# Altium project Hardware Hyperspace Chattels- master.PrjPCB
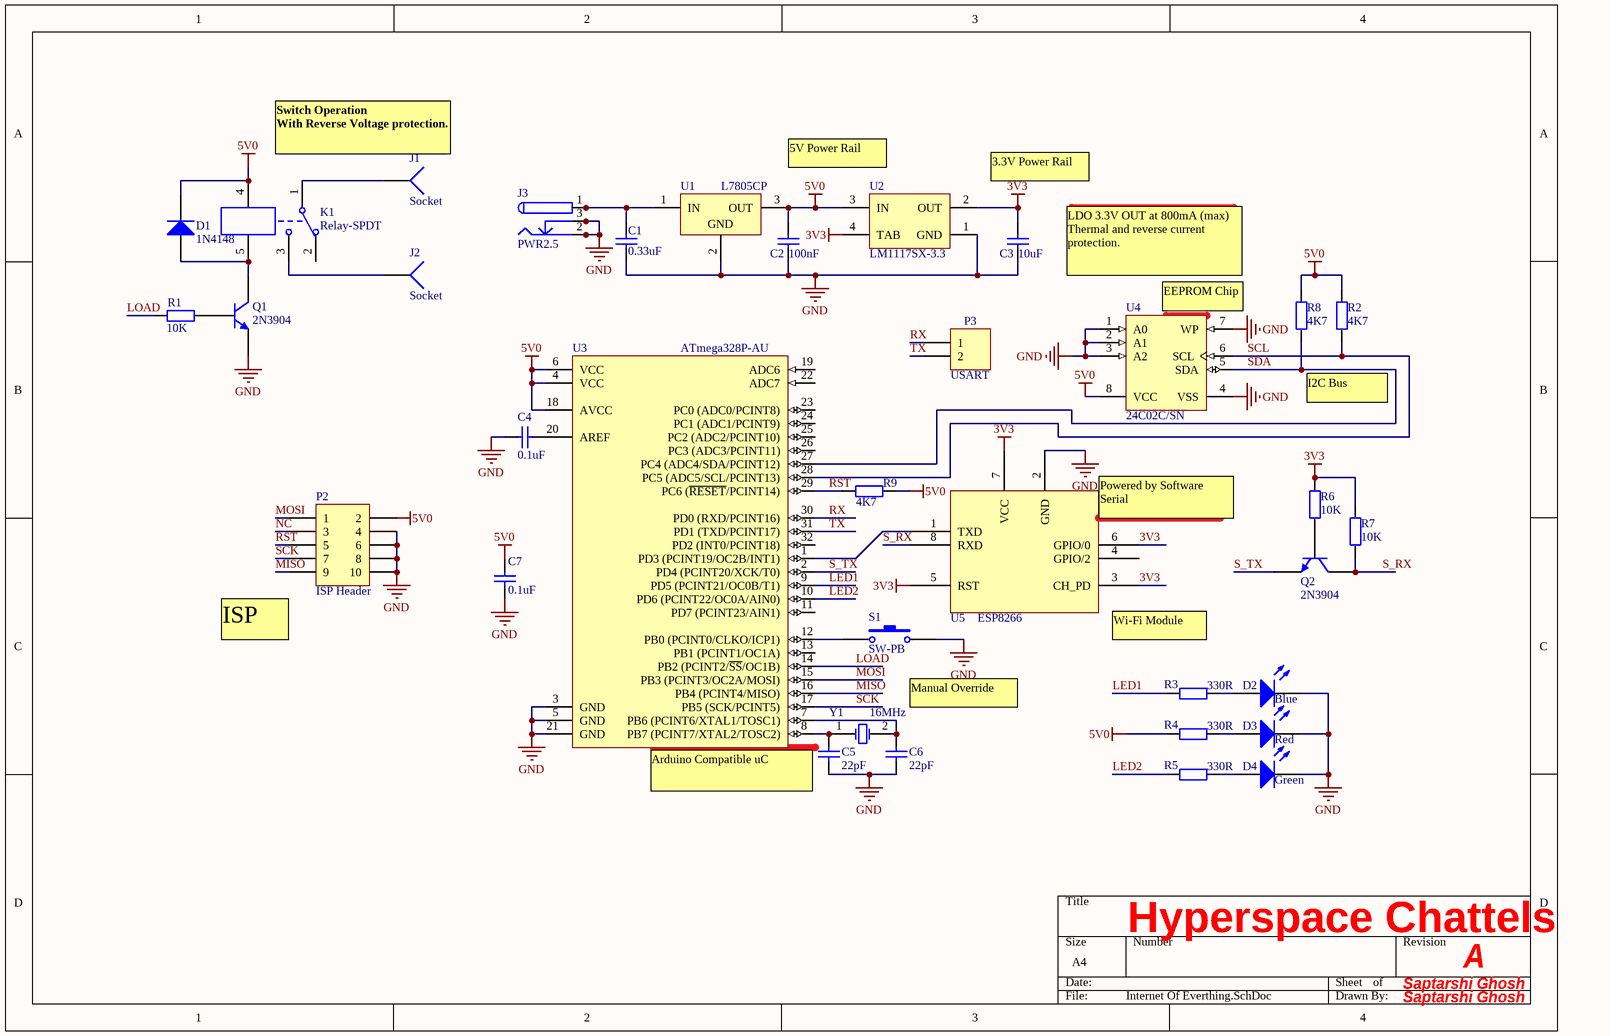
[diagram p0: Internet Of Everthing.SchDoc]
1 sheet, 35 parts. Net scope: global (net labels, ports and power ports of the same name join across sheets).
Board file: Internet Of Everthing.PcbDoc

## Sheet Internet Of Everthing.SchDoc
size A4

### Parts
C1  value 0.33uF  [6-0805_M]  (hidden comment: Cap)
C2  value 100nF  [6-0805_M]  (hidden comment: Cap)
C3  value 10uF  [6-0805_M]  (hidden comment: Cap)
C4  value 0.1uF  [6-0805_M]  (hidden comment: Cap)
C5  value 22pF  [6-0805_M]  (hidden comment: Cap)
C6  value 22pF  [6-0805_M]  (hidden comment: Cap)
C7  value 0.1uF  [6-0805_M]  (hidden comment: Cap)
D1  1N4148  [SOD-323]
D2  LED0  [6-0805_M]  (value not drawn)
D3  LED0  [6-0805_M]  (value not drawn)
D4  LED0  [6-0805_M]  (value not drawn)
J1  Socket  [PIN1]
J2  Socket  [PIN1]
J3  PWR2.5  [KLD-0202]
K1  Relay-SPDT  [G5LA-141]
P2  ISP Header  [HDR2X5]
P3  USART  [HDR1X2]
Q1  2N3904  [SOT-23_M]
Q2  2N3904  [SOT-23_M]
R1  value 10K  [6-0805_M]  (hidden comment: Res2)
R2  value 4K7  [6-0805_M]  (hidden comment: Res2)
R3  value 330R  [6-0805_M]  (hidden comment: Res2)
R4  value 330R  [6-0805_M]  (hidden comment: Res2)
R5  value 330R  [6-0805_M]  (hidden comment: Res2)
R6  value 10K  [6-0805_M]  (hidden comment: Res2)
R7  value 10K  [6-0805_M]  (hidden comment: Res2)
R8  value 4K7  [6-0805_M]  (hidden comment: Res2)
R9  value 4K7  [6-0805_M]  (hidden comment: g)
S1  SW-PB  [Tactile Swithc]
U1  L7805CP  [SOT223_M]
U2  LM1117SX-3.3  [SOT223_M]
U3  ATmega328P-AU  [32A_M]
U4  24C02C/SN  [SOIC-SN8_M]
U5  ESP8266  [HDR2X4]
Y1  16MHz  [RAD-0.2]

### Nets
3V3: C3.1 R6.1 R7.1 U2.2(OUT) U2.4(TAB) U5.3(CH_PD) U5.5(RST) U5.6(GPIO/0) U5.7(VCC)
5V0: C2.1 C7.2 D1.2(K) K1.4 P2.2 R2.2 R4.2 R8.2 R9.1 U1.3(OUT) U2.3(IN) U3.4(VCC) U3.6(VCC) U3.18(AVCC) U4.8(VCC)
GND: C1.1 C2.2 C3.2 C4.1 C5.2 C6.2 C7.1 D2.2(K) D3.2(K) D4.2(K) J3.2 J3.2A J3.2B J3.3 J3.3A J3.3B P2.4 P2.6 P2.8 P2.10 Q1.2(E) S1.2 U1.2(GND) U2.1(GND) U3.3(GND) U3.5(GND) U3.21(GND) U4.1(A0) U4.2(A1) U4.3(A2) U4.4(VSS) U4.7(WP) U5.2(GND)
LED1: R3.2 U3.9(PD5_(PCINT21/OC0B/T1))
LED2: R5.2 U3.10(PD6_(PCINT22/OC0A/AIN0))
LOAD: R1.1 U3.14(PB2_(PCINT2/~{SS}/OC1B))
MISO: P2.9 U3.16(PB4_(PCINT4/MISO))
MOSI: P2.1 U3.15(PB3_(PCINT3/OC2A/MOSI))
NC: P2.3
RST: P2.5 R9.2 U3.29(PC6_(~{RESET}/PCINT14))
RX: P3.1 U3.30(PD0_(RXD/PCINT16))
S_RX: Q2.3(C) R7.2 U5.8(RXD)
S_TX: Q2.2(E) U3.2(PD4_(PCINT20/XCK/T0))
SCK: P2.7 U3.17(PB5_(SCK/PCINT5))
SCL: R2.1 U3.28(PC5_(ADC5/SCL/PCINT13)) U4.6(SCL)
SDA: R8.1 U3.27(PC4_(ADC4/SDA/PCINT12)) U4.5(SDA)
TX: P3.2 U3.31(PD1_(TXD/PCINT17))
NetC1_2: C1.2 J3.1 J3.1A J3.1B U1.1(IN)
NetC4_2: C4.2 U3.20(AREF)
NetC5_1: C5.1 U3.8(PB7_(PCINT7/XTAL2/TOSC2)) Y1.1(OSC1)
NetC6_1: C6.1 U3.7(PB6_(PCINT6/XTAL1/TOSC1)) Y1.2(OSC2)
NetD1_1: D1.1(A) K1.5 Q1.3(C)
NetD2_1: D2.1(A) R3.1
NetD3_1: D3.1(A) R4.1
NetD4_1: D4.1(A) R5.1
NetJ1_1: J1.1 K1.1
NetJ2_1: J2.1 K1.3
NetQ1_1: Q1.1(B) R1.2
NetQ2_1: Q2.1(B) R6.2
NetS1_1: S1.1 U3.12(PB0_(PCINT0/CLKO/ICP1))
NetU3_1: U3.1(PD3_(PCINT19/OC2B/INT1)) U5.1(TXD)

Not connected (* = marked no-connect by the designer): K1 2; U3 11(PD7_(PCINT23/AIN1)) 13(PB1_(PCINT1/OC1A)) 19(ADC6) 22(ADC7) 23(PC0_(ADC0/PCINT8)) 24(PC1_(ADC1/PCINT9)) 25(PC2_(ADC2/PCINT10)) 26(PC3_(ADC3/PCINT11)) 32(PD2_(INT0/PCINT18)); U5 4(GPIO/2)

### Notes on the sheet
- (near J1) Switch Operation
  With Reverse Voltage protection.
- 5V Power Rail
- 3.3V Power Rail
- LDO 3.3V OUT at 800mA (max)
  Thermal and reverse current protection.
- (near U4) EEPROM Chip
- I2C Bus
- (near U5) Powered by Software Serial
- (near P2) ISP
- (near U5) Wi-Fi Module
- Manual Override
- (near D2) Blue
- Arduino Compatible uC
- (near D3) Red
- (near D4) Green
- Hyperspace Chattels
- Saptarshi Ghosh
- A

### Library data of the parts
C1-C7 = Cap: Capacitor; Published: 8-Jun-2000; LatestRevisionDate: 17-Jul-2002; LatestRevisionNote: Re-released for DXP Platform.; PackageReference: RAD-0.3; Publisher: Altium Limited; PackageDescription: Radial Cap, Thru-Hole; 2 Leads; 0.3 in Pin Spacing
D1 = 1N4148: High Conductance Fast Diode; Published: 8-Jun-2000; LatestRevisionDate: 17-Jul-2002; LatestRevisionNote: Re-released for DXP Platform.; DatasheetDocument: 1997; PackageReference: DO-35; Publisher: Altium Limited; Code_JEDEC: DO-204-AH; ComponentLink1Description: Manufacturer Link; ComponentLink1URL: http://www.fairchildsemi.com/; ComponentLink2Description: Datasheet; ComponentLink2URL: http://www.fairchildsemi.com/ds/1N%2F1N4148.pdf
D2-D4 = LED0: Typical INFRARED GaAs LED; Published: 8-Jun-2000; LatestRevisionDate: 08-Jul-2005; LatestRevisionNote: Mech Layer 1 removed.; PackageReference: LED-0; Publisher: Altium Limited; PackageDescription: LED; 2 Leads
J3 = PWR2.5: Low Voltage Power Supply Connector; Published: 17-Dec-2003; DatasheetDocument: 09-May-2002; Publisher: Altium Limited; ComponentLink1Description: Manufacturer Link; ComponentLink1URL: http://domino.kycon.com/internet/Products.html
K1 = Relay-SPDT: Single-Pole Dual-Throw Relay; Published: 24-Mar-1999; LatestRevisionDate: 17-Jul-2002; LatestRevisionNote: Re-released for DXP Platform.; PackageReference: MODULE5B; Publisher: Altium Limited
P2 = Header 5X2: Header, 5-Pin, Dual row; LatestRevisionDate: 17-Jul-2002; LatestRevisionNote: Re-released for DXP Platform.; Publisher: Altium Limited
P3 = Header 2: Header, 2-Pin; LatestRevisionDate: 17-Jul-2002; LatestRevisionNote: Re-released for DXP Platform.; Publisher: Altium Limited
Q1 Q2 = 2N3904: NPN General Purpose Amplifier; Published: 8-Jun-2000; LatestRevisionDate: 17-Jan-2003; LatestRevisionNote: PCB Footprint replaced; DatasheetVersion: 1997; PackageVersion: Sep-1998; PackageReference: TO-92A; Publisher: Altium Limited; PackageDescription: TO, Flat Index; 3 In-Line, Axial Leads; Body Dia. 4.5mm; Leads 0.51 x 0.48 mm (max); ComponentLink1Description: Manufacturer Link; ComponentLink1URL: http://www.fairchildsemi.com/; ComponentLink2Description: Datasheet; ComponentLink2URL: http://www.fairchildsemi.com/ds/2N%2F2N3904.pdf
R1-R9 = Res2: Resistor; Published: 8-Jun-2000; LatestRevisionDate: 17-Jul-2002; LatestRevisionNote: Re-released for DXP Platform.; PackageReference: AXIAL-0.4; Publisher: Altium Limited; PackageDescription: Axial Device, Thru-Hole; 2 Leads; 0.4 in Pin Spacing
S1 = SW-PB: Switch; Published: 24-Mar-1999; LatestRevisionDate: 17-Jul-2002; LatestRevisionNote: Re-released for DXP Platform.; PackageReference: SPST-2; Publisher: Altium Limited; PackageDescription: Switch; 2 Leads
U1 = L7805CP: Positive Voltage Regulator; Note: Tab is connected to pin 3 (GND).; Published: 24-Aug-2001; LatestRevisionDate: 17-Jul-2002; LatestRevisionNote: Re-released for DXP Platform.; DatasheetVersion: Dec-1998; PackageVersion: Jul-1998; PackageReference: ISOWATT220AB; Publisher: Altium Limited; PackageDescription: TO, Thru-Hole, Vertical, Heatsink Mounted; 3 In-Line Leads; Pitch 2.54 mm; Pin sequence 1, 3, 2; ComponentLink1Description: Manufacturer Link; ComponentLink1URL: http://www.st.com/
U2 = LM1117SX-3.3: 800mA Low-Dropout Linear Regulator, 3-pin TO-263; Manufacturer: National Semiconductor; PackageTopMarking: NSUZXYTTE#*LM1117S*3.3; PowerWise: N; CompType: LDO IC; Published: 1-Mar-2010; DatasheetVersion: Apr-2006; PackageVersion: revF, Apr-2005; PackageReference: TS3B; Publisher: Altium Limited; PackageDescription: TO-263, Molded, .400 x .390 x .180in, 3 Lead, .1in Pitch, Surface Mount; PartNumber: LM1117SX-3.3; RoHS: N; PinCount: 3; Code_JEDEC: MO-169-AA; ComponentLink1Description: LM1117 Datasheet; ComponentLink1URL: http://www.national.com/ds/LM/LM1117.pdf; ComponentLink2Description: LM1117 Web Page; ComponentLink2URL: http://www.national.com/pf/LM/LM1117.html; ComponentLink3Description: TS3B Package Page; ComponentLink3URL: http://www.national.com/packaging/folders/ts3b.html
U3 = ATmega328P-AU: 8-bit AVR Microcontroller, 32KB Flash, 1KB EEPROM, 2KB SRAM, 32-pin TQFP, Industrial Grade (-40°C to 85°C); Published: 1-Apr-2010; DatasheetVersion: revA, Jan-2010; PackageVersion: revB, Oct-2001; PackageReference: 32A; Publisher: Altium Limited; PackageDescription: 32-Lead, 7x7x1.0 mm Body, 0.8mm Lead Pitch, Thin Profile Plastic Quad Flat Package (TQFP); Supplier 1: Digi-Key; Supplier Part Number 1: ATMEGA328P-AU-ND; Supplier 2: Farnell; Supplier Part Number 2: 1715486; Supplier 3: Mouser; Supplier Part Number 3: 556-ATMEGA328P-AU; Code_JEDEC: MS-026-ABA; ComponentLink1Description: Manufacturer Link; ComponentLink1URL: http://www.atmel.com/products/avr/default.asp?; ComponentLink2Description: ATmega48A/48PA/88A/88PA/168A/168PA/328/328P Datasheet; ComponentLink2URL: http://www.atmel.com/dyn/resources/prod_documents/8271.pdf; ComponentLink3Description: ATmega48A/48PA/88A/88PA/168A/168PA/328/328P Summary; ComponentLink3URL: http://www.atmel.com/dyn/resources/prod_documents/8271S.pdf; ComponentLink4Description: Atmel.com Home; ComponentLink4URL: http://www.atmel.com
U4 = 24C02C/SN: 2Kbit, 400kHz, 5V, I2C Serial EEPROM, 8-Pin SOIC 150mil, Commercial Temperature; Published: 29-Jan-2009; DatasheetVersion: revJ, Aug-2008; PackageVersion: revBB, Aug-2009; PackageReference: SOIC-SN8; Publisher: Altium Limited; PackageDescription: 8-Lead Plastic Small Outline (SN) - Narrow, 3.90mm Body [SOIC]; Supplier 1: Digi-Key; Supplier Part Number 1: 24C02C/SN-ND; Supplier 2: Farnell; Supplier Part Number 2: 1607552; Code_JEDEC: MS-012; Code_IPC: SOIC127P600-8; ComponentLink1Description: Datasheet; ComponentLink1URL: http://ww1.microchip.com/downloads/en/DeviceDoc/21202J.pdf; ComponentLink2Description: Packaging Specification; ComponentLink2URL: http://www.microchip.com/stellent/groups/techpub_sg/documents/packagingspec/en012702.pdf; ComponentLink3Description: Microchip.com Home; ComponentLink3URL: http://www.microchip.com/
U5 = ESP8266: Low cost, Wi-Fi module
Y1 = XTAL: Crystal Oscillator; Published: 8-Jun-2000; LatestRevisionDate: 17-Jul-2002; LatestRevisionNote: Re-released for DXP Platform.; PackageReference: R38; Publisher: Altium Limited; PackageDescription: Crystal, Thru-Hole; 2 Leads; Body 3.1 x 8.2 mm (Dia.xH)
J1 J2 = Socket: LatestRevisionDate: 17-Jul-2002; LatestRevisionNote: Re-released for DXP Platform.; Publisher: Altium Limited